# Altium schematic sheet Payload.SchDoc
size A4; SheetNumber: 1; SheetTotal: 1
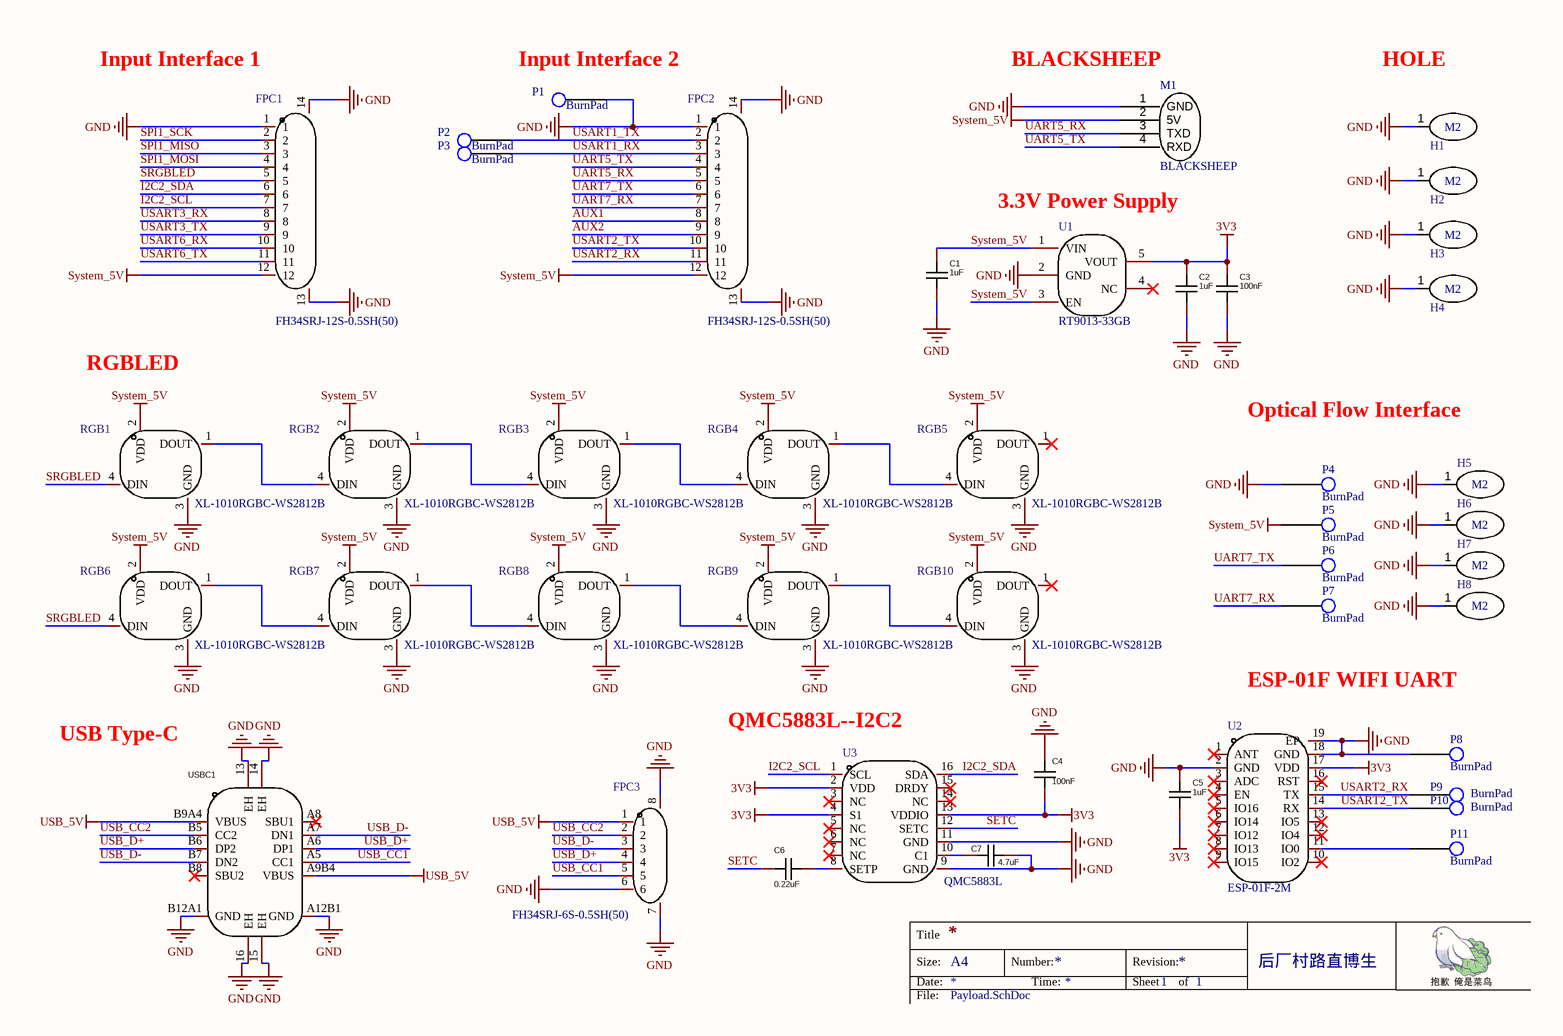
[diagram p0: Payload.SchDoc]

## Parts
C1  1uF  [C0402]
C2  1uF  [C0402]
C3  100nF  [C0201]
C4  100nF  [C0201]
C5  1uF  [C0402]
C6  0.22uF  [C0402]
C7  4.7uF  [C0402]
FPC1  FH34SRJ-12S-0.5SH(50)  [FFC-SMD_12P-P0.50_FH34SRJ-12S-0.5SH]
FPC2  FH34SRJ-12S-0.5SH(50)  [FFC-SMD_12P-P0.50_FH34SRJ-12S-0.5SH]
FPC3  FH34SRJ-6S-0.5SH(50)  [FFC-SMD_6P-P0.50_FH34SRJ-6S-0.5SH]
H1  M2_HOLE  [M2_HOLE]  (value not drawn)
H2  M2_HOLE  [M2_HOLE]  (value not drawn)
H3  M2_HOLE  [M2_HOLE]  (value not drawn)
H4  M2_HOLE  [M2_HOLE]  (value not drawn)
H5  M2_HOLE  [M2_HOLE]  (value not drawn)
H6  M2_HOLE  [M2_HOLE]  (value not drawn)
H7  M2_HOLE  [M2_HOLE]  (value not drawn)
H8  M2_HOLE  [M2_HOLE]  (value not drawn)
M1  BLACKSHEEP  [BLACKSHEEP]
P1  BurnPad  [BurnPad_0.8mm]
P2  BurnPad  [BurnPad_0.8mm]
P3  BurnPad  [BurnPad_0.8mm]
P4  BurnPad  [BurnPad_0.8mm]
P5  BurnPad  [BurnPad_0.8mm]
P6  BurnPad  [BurnPad_0.8mm]
P7  BurnPad  [BurnPad_0.8mm]
P8  BurnPad  [BurnPad_0.8mm]
P9  BurnPad  [BurnPad_0.8mm]
P10  BurnPad  [BurnPad_0.8mm]
P11  BurnPad  [BurnPad_0.8mm]
RGB1  XL-1010RGBC-WS2812B  [LED-SMD_4P-L1.0-W1.0-TL_XL-1010RGBC-WS2812B]
RGB2  XL-1010RGBC-WS2812B  [LED-SMD_4P-L1.0-W1.0-TL_XL-1010RGBC-WS2812B]
RGB3  XL-1010RGBC-WS2812B  [LED-SMD_4P-L1.0-W1.0-TL_XL-1010RGBC-WS2812B]
RGB4  XL-1010RGBC-WS2812B  [LED-SMD_4P-L1.0-W1.0-TL_XL-1010RGBC-WS2812B]
RGB5  XL-1010RGBC-WS2812B  [LED-SMD_4P-L1.0-W1.0-TL_XL-1010RGBC-WS2812B]
RGB6  XL-1010RGBC-WS2812B  [LED-SMD_4P-L1.0-W1.0-TL_XL-1010RGBC-WS2812B]
RGB7  XL-1010RGBC-WS2812B  [LED-SMD_4P-L1.0-W1.0-TL_XL-1010RGBC-WS2812B]
RGB8  XL-1010RGBC-WS2812B  [LED-SMD_4P-L1.0-W1.0-TL_XL-1010RGBC-WS2812B]
RGB9  XL-1010RGBC-WS2812B  [LED-SMD_4P-L1.0-W1.0-TL_XL-1010RGBC-WS2812B]
RGB10  XL-1010RGBC-WS2812B  [LED-SMD_4P-L1.0-W1.0-TL_XL-1010RGBC-WS2812B]
U1  RT9013-33GB  [SOT-23-5]
U2  ESP-01F-2M  [WIFIM-SMD_ESP-01F-2M]
U3  QMC5883L  [LGA-16_L3.0-W3.0-P0.50-BL_SQ]
USBC1  918-418K2024S40000  [USB-C-SMD_TYPE-C-USB-4]  (value not drawn)

## Nets
3V3: C2.1 C3.1 C4.1 C5.2 U1.5(VOUT) U2.17(VDD) U3.2(VDD) U3.4(S1) U3.13(VDDIO)
GND: C1.2 C2.2 C3.2 C4.2 C5.1 C7.1 FPC1.1 FPC1.13 FPC1.14 FPC2.1 FPC2.13 FPC2.14 FPC3.6 FPC3.7 FPC3.8 H1.1 H2.1 H3.1 H4.1 H5.1 H6.1 H7.1 H8.1 M1.1(GND) P1.1 P4.1 P8.1 RGB1.3(GND) RGB2.3(GND) RGB3.3(GND) RGB4.3(GND) RGB5.3(GND) RGB6.3(GND) RGB7.3(GND) RGB8.3(GND) RGB9.3(GND) RGB10.3(GND) U1.2(GND) U2.2(GND) U2.18(GND) U2.19(EP) U3.9(GND) U3.11(GND) USBC1.13(EH) USBC1.14(EH) USBC1.15(EH) USBC1.16(EH) USBC1.A12B1(GND) USBC1.B12A1(GND)
System_5V: C1.1 FPC1.12 FPC2.12 M1.2(5V) P5.1 RGB1.2(VDD) RGB2.2(VDD) RGB3.2(VDD) RGB4.2(VDD) RGB5.2(VDD) RGB6.2(VDD) RGB7.2(VDD) RGB8.2(VDD) RGB9.2(VDD) RGB10.2(VDD) U1.1(VIN) U1.3(EN)
USB_5V: FPC3.1 USBC1.A9B4(VBUS) USBC1.B9A4(VBUS)
AUX1: FPC2.8
AUX2: FPC2.9
I2C2_SCL: FPC1.7 U3.1(SCL)
I2C2_SDA: FPC1.6 U3.16(SDA)
SETC: C6.2 U3.12(SETC)
SPI1_MISO: FPC1.3
SPI1_MOSI: FPC1.4
SPI1_SCK: FPC1.2
SRGBLED: FPC1.5 RGB1.4(DIN) RGB6.4(DIN)
UART5_RX: FPC2.5 M1.3(TXD)
UART5_TX: FPC2.4 M1.4(RXD)
UART7_RX: FPC2.7 P7.1
UART7_TX: FPC2.6 P6.1
USART1_RX: FPC2.3 P3.1
USART1_TX: FPC2.2 P2.1
USART2_RX: FPC2.11 P9.1 U2.15(TX)
USART2_TX: FPC2.10 P10.1 U2.14(RX)
USART3_RX: FPC1.8
USART3_TX: FPC1.9
USART6_RX: FPC1.10
USART6_TX: FPC1.11
USB_CC1: FPC3.5 USBC1.A5(CC1)
USB_CC2: FPC3.2 USBC1.B5(CC2)
USB_D+: FPC3.4 USBC1.A6(DP1) USBC1.B6(DP2)
USB_D-: FPC3.3 USBC1.A7(DN1) USBC1.B7(DN2)
NetC6_1: C6.1 U3.8(SETP)
NetC7_2: C7.2 U3.10(C1)
NetP11_1: P11.1 U2.11(IO0)
NetRGB1_1: RGB1.1(DOUT) RGB2.4(DIN)
NetRGB2_1: RGB2.1(DOUT) RGB3.4(DIN)
NetRGB3_1: RGB3.1(DOUT) RGB4.4(DIN)
NetRGB4_1: RGB4.1(DOUT) RGB5.4(DIN)
NetRGB6_1: RGB6.1(DOUT) RGB7.4(DIN)
NetRGB7_1: RGB7.1(DOUT) RGB8.4(DIN)
NetRGB8_1: RGB8.1(DOUT) RGB9.4(DIN)
NetRGB9_1: RGB9.1(DOUT) RGB10.4(DIN)

Not connected (* = marked no-connect by the designer): RGB5 1(DOUT)*; RGB10 1(DOUT)*; U1 4(NC)*; U2 1(ANT)* 3(ADC)* 4(EN)* 5(IO16)* 6(IO14)* 7(IO12)* 8(IO13)* 9(IO15)* 10(IO2)* 12(IO4)* 13(IO5)* 16(RST)*; U3 3(NC)* 5(NC)* 6(NC)* 7(NC)* 14(NC)* 15(DRDY)*; USBC1 A8(SBU1)* B8(SBU2)*

## Notes on the sheet
- (near FPC1) Input Interface 1
- Input Interface 2
- (near M1) BLACKSHEEP
- HOLE
- 3.3V Power Supply
- RGBLED
- Optical Flow Interface
- ESP-01F WIFI UART
- USB Type-C
- (near U3) QMC5883L--I2C2
- Title
- Size:
- Date:
- A4
- Number:
- Time:
- Revision:
- Sheet
- of
- 后厂村路直博生
- File:
- (in symbol M2_HOLE) M2

## Library data of the parts
C1-C7 = CC0603KRX7R9BB104: Add into BOM: yes; Convert to PCB: yes
  C1 C2 C5: Name: 1uF; Value: 1uF
  C3 C4: Name: 100nF; Value: 100nF
  C6: Name: 0.22uF; Value: 0.22uF
  C7: Name: 4.7uF; Value: 4.7uF
FPC1 FPC2 = FH34SRJ-12S-0.5SH(50): Manufacturer: HRS(广濑); Add into BOM: yes; Number of Contacts: 12P; Pitch: 0.5mm; FFC, FCB Thickness: 0.3mm; Symbol: FH34SRJ-12S-0.5SH(50); Device: FH34SRJ-12S-0.5SH(50); Supplier: LCSC; Supplier Part: C424659; Manufacturer Part: FH34SRJ-12S-0.5SH(50); JLCPCB Part Class: Extended Part; LCSC Part Name: 间距:0.5mm P数:12P 双侧触点/上下接; Supplier Footprint: SMD,P=0.5mm,卧贴; Datasheet: https://atta.szlcsc.com/upload/public/pdf/source/20190903/C424660_13F2CCC518A089E10A5EDDF0ACBC803F.pdf; Convert to PCB: yes; Locking Feature: -; Contact Type: 双侧触点/上下接; Mounting Type: 卧贴; Height Above Board: 1mm; Contact Material: 磷青铜; Contact Plating: 金; Operating Temperature Range: -55℃~+105℃
FPC3 = FH34SRJ-6S-0.5SH(50): Manufacturer: HRS(广濑); Add into BOM: yes; Number of Contacts: 6P; Pitch: 0.5mm; FFC, FCB Thickness: 0.3mm; Symbol: FH34SRJ-6S-0.5SH(50); Device: FH34SRJ-6S-0.5SH(50); Supplier: LCSC; Supplier Part: C224194; Manufacturer Part: FH34SRJ-6S-0.5SH(50); JLCPCB Part Class: Extended Part; LCSC Part Name: 间距:0.5mm P数:6P 双侧触点/上下接; Supplier Footprint: SMD,P=0.5mm,卧贴; Datasheet: https://atta.szlcsc.com/upload/public/pdf/source/20180712/C224194_08937A353F43080B85824A8384727686.pdf; Convert to PCB: yes; Locking Feature: -; Contact Type: 双侧触点/上下接; Mounting Type: 卧贴; Height Above Board: 1mm; Contact Material: 磷青铜; Contact Plating: 金; Operating Temperature Range: -55℃~+105℃; Soldering Temperature(Max): -
RGB1-RGB10 = XL-1010RGBC-WS2812B: Manufacturer: XINGLIGHT(成兴光); Add into BOM: yes; Emitted Color: RGB三色; Forward Voltage (VF): 3.5V~5.5V; Forward Current: 20mA; Dominant Wavelength: 465nm~475nm；520nm~530nm；620nm~625nm; Lens Color: 无色透明透镜; Luminous Intensity: 300mcd；800mcd；200mcd; Viewing Angle: 120°; Mounting Sytle: 正贴; Symbol: XL-1010RGBC-WS2812B; Device: XL-1010RGBC-WS2812B; LCSC Part Name: XL-1010RGBC-WS2812B; Supplier Part: C5349953; Manufacturer Part: XL-1010RGBC-WS2812B; Supplier Footprint: SMD,1x1mm; JLCPCB Part Class: Extended Part; Datasheet: https://atta.szlcsc.com/upload/public/pdf/source/20230111/7F92487BABF607E2EE42D1D66EFE1A21.pdf; Supplier: LCSC; Convert to PCB: yes; Power Dissipation: -; Peak Wavelength: -; Operating Temperature: -20℃~+85℃
U1 = RT9013-33GB: Manufacturer: RICHTEK(立锜); Add into BOM: yes; Output Type: 固定; Output Polarity: 正; Number of Outputs: 1; Maximum Input Voltage: 5.5V; Output Voltage: 3.3V; Dropout Voltage: 400mV@(500mA); Quiescent Current (Ground Current): 50uA; Output Current: 500mA; Power Supply Rejection Ratio (PSRR): 50dB@(10kHz); Name: RT9013-33GB; Symbol: RT9013-33GB; Device: RT9013-33GB; LCSC Part Name: 输入5.5V 输出3.3V 500mA; Supplier Part: C47773; Manufacturer Part: RT9013-33GB; Supplier Footprint: SOT-23-5; JLCPCB Part Class: Extended Part; Datasheet: https://atta.szlcsc.com/upload/public/pdf/source/20150504/1457707282459.pdf; Supplier: LCSC; Convert to PCB: yes; Noise: -; Feature: -; Operating Temperature: -40℃~+85℃
U2 = ESP-01F-2M: Manufacturer: Ai-Thinker(安信可); Add into BOM: yes; Core Processor: ESP8285芯片; Support Interface: GPIO；UART；I2C；PWM；SPI；ADC; Value: 2.4GHz; Output Power: 16dBm; Operating Voltage: 3V~3.6V; Receive  Current: 56mA; Send  Current: 170mA; Sensitivity: -90dBm; Symbol: ESP-01F-2M; Device: ESP-01F-2M; LCSC Part Name: 完整的802.11b/g/nWi-FiSoC模块; Supplier Part: C2764054; Manufacturer Part: ESP-01F-2M; Supplier Footprint: -; JLCPCB Part Class: Extended Part; Datasheet: https://atta.szlcsc.com/upload/public/pdf/source/20210401/C2764054_7A91A27C6594F8A1968F9CAA7474E658.pdf; Supplier: LCSC; Convert to PCB: yes; Wireless Standard: -; Antenna Type: -; Operating Temperature: -40℃~+85℃
U3 = QMC5883L: Manufacturer: QST(上海矽睿); Add into BOM: yes; Symbol: QMC5883L; Device: QMC5883L; LCSC Part Name: 三轴磁传感器; Supplier Part: C976032; Manufacturer Part: QMC5883L; Supplier Footprint: LGA-16(3x3); JLCPCB Part Class: Extended Part; Datasheet: https://atta.szlcsc.com/upload/public/pdf/source/20201217/C976032_5B9A2F3901E175046CBA037B1F18A1F2.pdf; Supplier: LCSC; Convert to PCB: yes
USBC1 = 918-418K2024S40000: Manufacturer: 精拓金; Symbol: TYPE-C 3.1 MT 16P_C168688; Add into BOM: yes; Connector Type: Type-C; Gender: 母座; Number of Contacts: 16P; Number of Ports: 1; Name: 918-418K2024S40000; Device: 918-418K2024S40000; LCSC Part Name: Type-C 母座; Supplier Part: C168688; Manufacturer Part: 918-418K2024S40000; Supplier Footprint: SMD; JLCPCB Part Class: Extended Part; Datasheet: https://atta.szlcsc.com/upload/public/pdf/source/20230504/AD68741A173EB676C7BDD03FFA4DE90F.pdf; Supplier: LCSC; Convert to PCB: yes; Standard: -